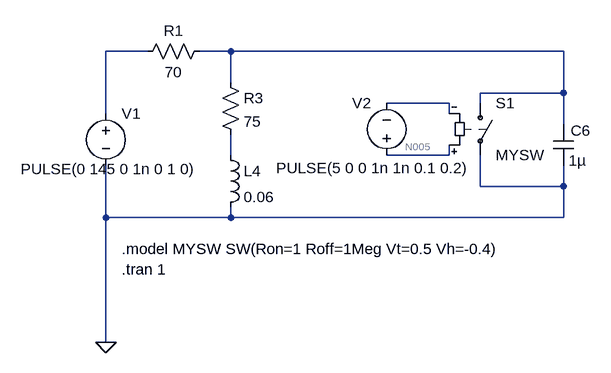
[diagram p0: schematic raschetnaya_rabota3.asc]
raschetnaya_rabota3.asc, the LTspice schematic file:
Version 4
SHEET 1 880 680
WIRE -240 -64 -304 -64
WIRE -112 -64 -160 -64
WIRE 400 -64 -112 -64
WIRE -112 -16 -112 -64
WIRE 400 0 400 -64
WIRE 400 0 272 0
WIRE 224 16 128 16
WIRE 272 16 272 0
WIRE -304 32 -304 -64
WIRE 224 32 224 16
WIRE 400 48 400 0
WIRE -112 96 -112 64
WIRE 224 96 224 80
WIRE 224 96 128 96
WIRE 272 144 272 96
WIRE 400 144 400 112
WIRE 400 144 272 144
WIRE -304 192 -304 112
WIRE -112 192 -112 176
WIRE -112 192 -304 192
WIRE 400 192 400 144
WIRE 400 192 -112 192
WIRE -304 384 -304 192
FLAG -304 384 0
SYMBOL voltage -304 16 R0
WINDOW 3 -131 101 Left 2
WINDOW 123 0 0 Left 0
WINDOW 39 0 0 Left 0
SYMATTR Value PULSE(0 145 0 1n 0 1 0)
SYMATTR InstName V1
SYMBOL sw 272 0 R0
SYMATTR InstName S1
SYMATTR Value MYSW
SYMBOL voltage 128 112 R180
WINDOW 0 24 96 Left 2
WINDOW 3 -127 -4 Left 2
WINDOW 123 0 0 Left 0
WINDOW 39 0 0 Left 0
SYMATTR InstName V2
SYMATTR Value PULSE(5 0 0 1n 1n 0.1 0.2)
SYMBOL cap 384 48 R0
WINDOW 0 27 10 Left 2
SYMATTR InstName C6
SYMATTR Value 1µ
SYMBOL res -144 -80 R90
WINDOW 0 0 56 VBottom 2
WINDOW 3 32 56 VTop 2
SYMATTR InstName R1
SYMATTR Value 70
SYMBOL res -128 -32 R0
SYMATTR InstName R3
SYMATTR Value 75
SYMBOL ind -128 80 R0
SYMATTR InstName L4
SYMATTR Value 0.06
TEXT -280 240 Left 2 !.model MYSW SW(Ron=1 Roff=1Meg Vt=0.5 Vh=-0.4)
TEXT -280 272 Left 2 !.tran 1

The netlist it stands for:
* raschetnaya_rabota3.asc
V1 N001 0 PULSE(0 145 0 1n 0 1 0)
S1 N002 0 N005 N003 MYSW
V2 N005 N003 PULSE(5 0 0 1n 1n 0.1 0.2)
C6 N002 0 1µ
R1 N002 N001 70
R3 N002 N004 75
L4 N004 0 0.06
.model MYSW SW(Ron=1 Roff=1Meg Vt=0.5 Vh=-0.4)
.tran 1
.backanno
.end

* Results of the author's LTspice run, read from the files saved beside the schematic
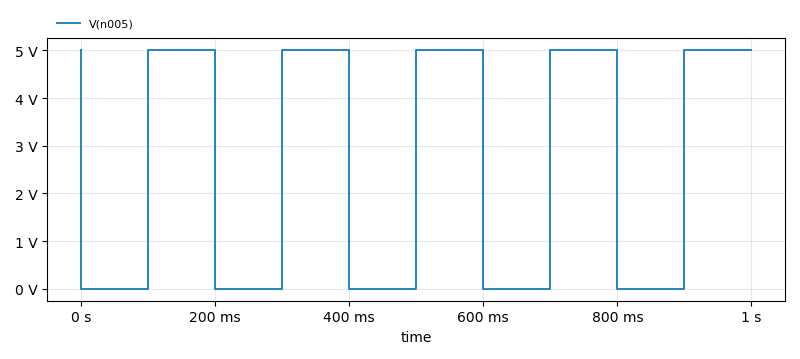
[diagram p1: Transient Analysis of raschetnaya_rabota3.asc, plotted from the saved traces]
* Transient Analysis, 1 run:
*   V(n005): min 0 V, max 5 V, average 2.5 V, rms 3.536 V, last 5 V